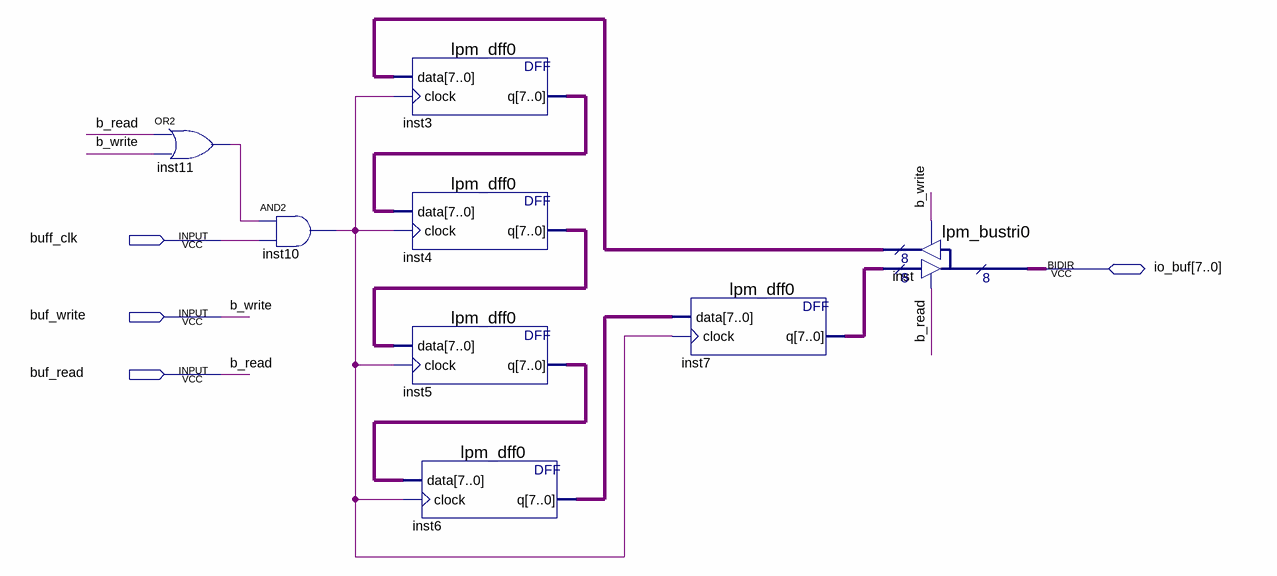
[diagram p0: schematic sheet]
// Quartus schematic buffer.bdf as structural Verilog: 8 symbols, 4 pins
module buffer (
  input  buff_clk,
  input  buf_write,
  input  buf_read,
  inout  [7:0] io_buf
);

  wire inst10_out, inst11_out;
  wire [7:0] inst3_q, inst4_q, inst5_q, inst6_q, inst7_q, inst_result;

  or inst11 (inst11_out, buf_read, buf_write);
  and inst10 (inst10_out, inst11_out, buff_clk);
  lpm_dff0 inst3 (.data(inst_result), .clock(inst10_out), .q(inst3_q));
  lpm_dff0 inst4 (.data(inst3_q), .clock(inst10_out), .q(inst4_q));
  lpm_dff0 inst5 (.data(inst4_q), .clock(inst10_out), .q(inst5_q));
  lpm_dff0 inst6 (.data(inst5_q), .clock(inst10_out), .q(inst6_q));
  lpm_dff0 inst7 (.data(inst6_q), .clock(inst10_out), .q(inst7_q));
  lpm_bustri0 inst (.enabledt(buf_read), .data(inst7_q), .enabletr(buf_write), .result(inst_result), .tridata(io_buf));

  // Other names for the same wires on the sheet: b_read = buf_read; b_write = buf_write
endmodule
